# Altium schematic sheet SC.SchDoc
size A4
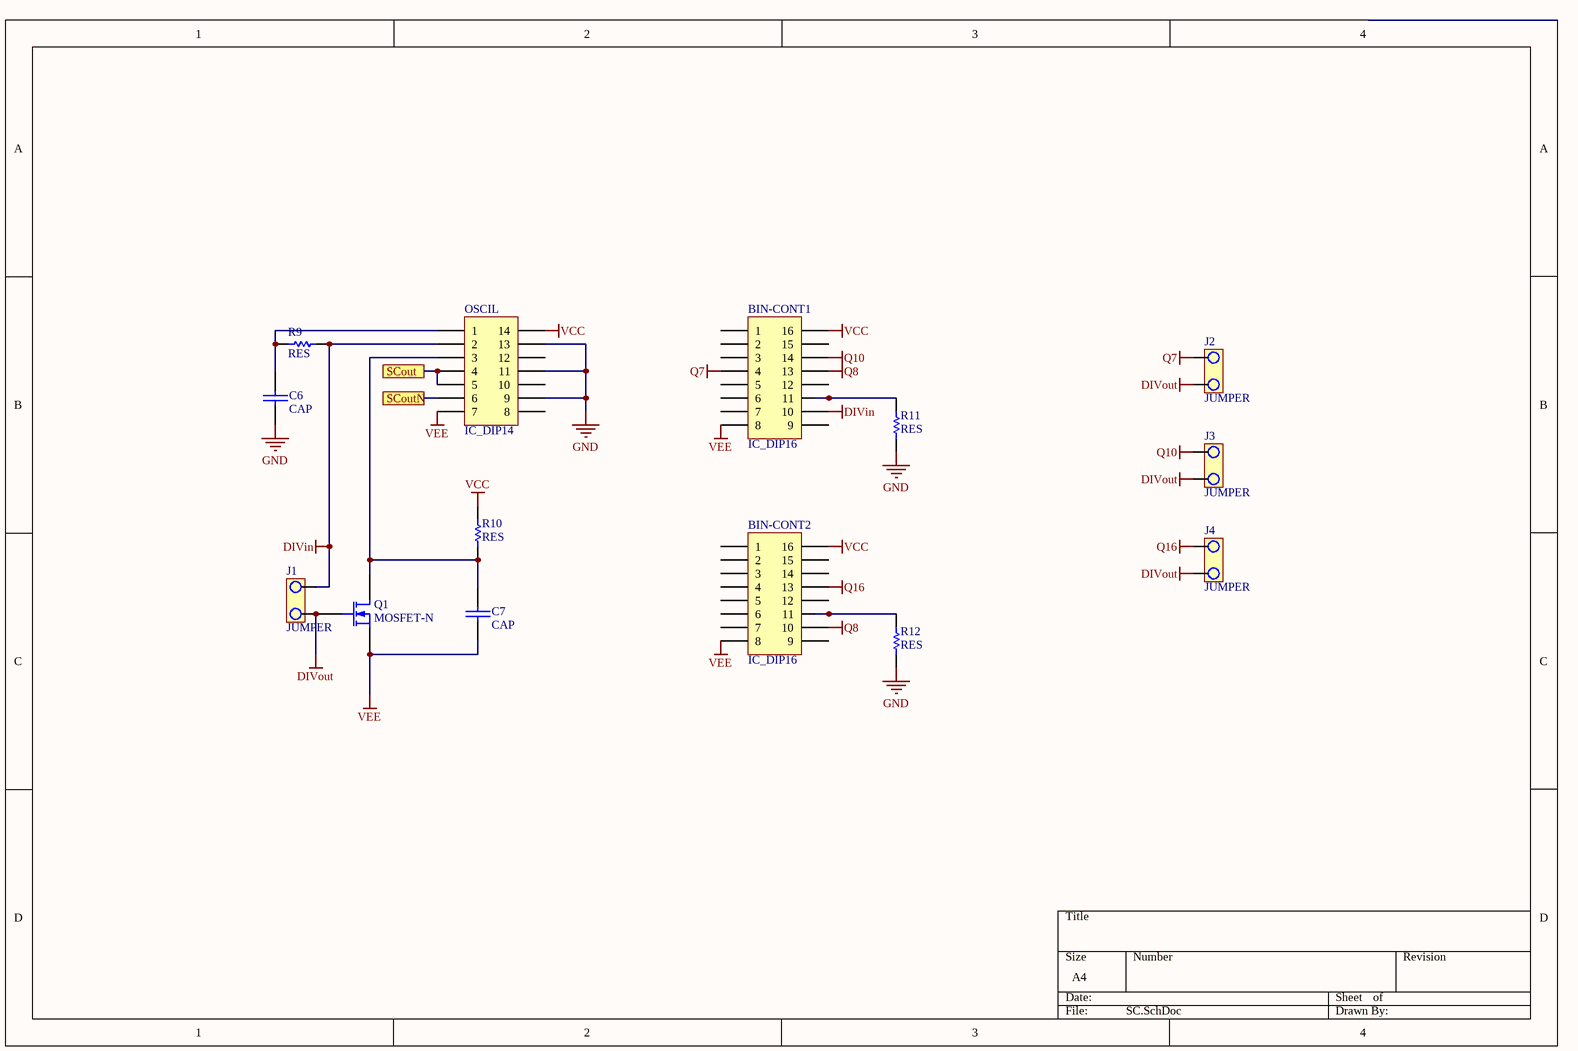
[diagram p0: SC.SchDoc]

## Parts
BIN-CONT1  IC_DIP16  [D016_M]
BIN-CONT2  IC_DIP16  [D016_M]
C6  CAP  [1206]
C7  CAP  [1206]
J1  JUMPER  [0805]
J2  JUMPER  [0805]
J3  JUMPER  [0805]
J4  JUMPER  [0805]
OSCIL  IC_DIP14  [D014_M]
Q1  MOSFET-N  [SOT-343_M]
R9  RES  [1206]
R10  RES  [1206]
R11  RES  [1206]
R12  RES  [1206]

## Ports
SCout, SCoutN

## Nets
DIVin: BIN-CONT1.10 J1.1 OSCIL.2 R9.2
DIVout: J1.2 J2.1 J3.1 J4.1 Q1.2(G)
GND: C6.1 OSCIL.9 OSCIL.11 OSCIL.13 R11.1 R12.1
Q7: BIN-CONT1.4 J2.2
Q8: BIN-CONT1.13 BIN-CONT2.10
Q10: BIN-CONT1.14 J3.2
Q16: BIN-CONT2.13 J4.2
VCC: BIN-CONT1.16 BIN-CONT2.16 OSCIL.14 R10.2
VEE: BIN-CONT1.8 BIN-CONT2.8 C7.1 OSCIL.7 Q1.3(S)
SCout: OSCIL.4 OSCIL.5 ; port SCout
SCoutN: OSCIL.6 ; port SCoutN
NetBIN-CONT1_11: BIN-CONT1.11 R11.2
NetBIN-CONT2_11: BIN-CONT2.11 R12.2
NetC6_2: C6.2 OSCIL.1 R9.1
NetC7_2: C7.2 OSCIL.3 Q1.1(D) R10.1

Not connected (* = marked no-connect by the designer): BIN-CONT1 1 2 3 5 6 7 9 12 15; BIN-CONT2 1 2 3 4 5 6 7 9 12 14 15; OSCIL 8 10 12

## Library data of the parts
Q1 = MOSFET-N: N-Channel MOSFET; Published: 8-Jun-2000; LatestRevisionDate: 17-Jul-2002; LatestRevisionNote: Re-released for DXP Platform.; PackageVersion: 1995/1996; PackageReference: E3; Publisher: Altium Limited; PackageDescription: TO, Flat Index; 3 In-Line, Axial Leads; Body Dia. 4.6mm; Lead Dia. 0.5 mm (max)